# Altium schematic sheet OZ440-SE140-CAR001_sheet2_power_supply.SchDoc
size A3
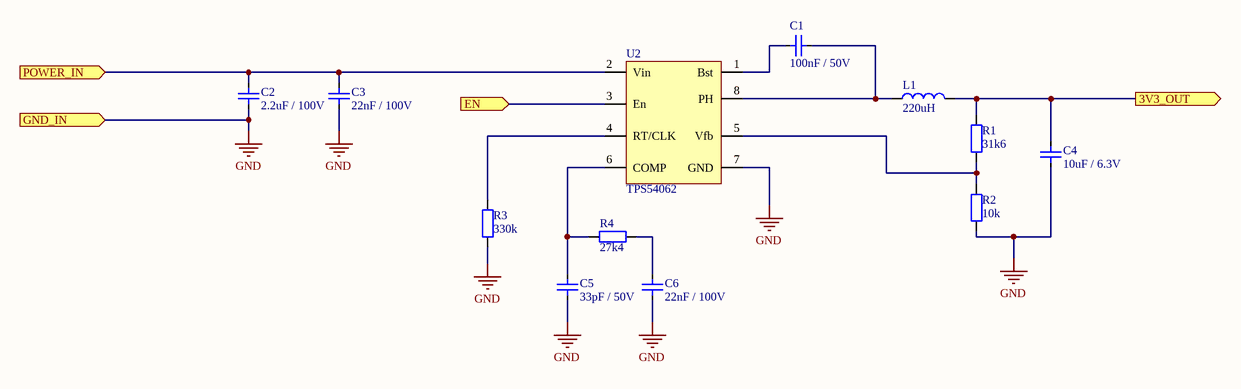
[diagram p0: OZ440-SE140-CAR001_sheet2_power_supply.SchDoc]

## Parts
C1  Displayed reference: 100nF / 50V  [C0805-STD]  (hidden comment: CAP-SMD)
C2  Displayed reference: 2.2uF / 100V  [C1206-STD]  (hidden comment: CAP-SMD)
C3  Displayed reference: 22nF / 100V  [C0805-STD]  (hidden comment: CAP-SMD)
C4  Displayed reference: 10uF / 6.3V  [C0805-STD]  (hidden comment: CAP-SMD)
C5  Displayed reference: 33pF / 50V  [C0805-STD]  (hidden comment: CAP-SMD)
C6  Displayed reference: 22nF / 100V  [C0805-STD]  (hidden comment: CAP-SMD)
L1  Displayed reference: 220uH  [L-SPE-4600Series_Murata]  (hidden comment: IND-SMD)
R1  Displayed reference: 31k6  [R0805-STD]  (hidden comment: RES-SMD)
R2  Displayed reference: 10k  [R0805-STD]  (hidden comment: RES-SMD)
R3  Displayed reference: 330k  [R0805-STD]  (hidden comment: RES-SMD)
R4  Displayed reference: 27k4  [R0805-STD]  (hidden comment: RES-SMD)
U2  Displayed reference: TPS54062  [MSOP08-SPE-TPS54062]  (hidden comment: TPS54062-MSOP8)

## Ports
3V3_OUT (out), EN (in), GND_IN (in), POWER_IN (in)

## Nets
GND: C2.1 C3.1 C4.1 C5.1 C6.1 R2.1 R3.1 U2.7(GND) ; port GND_IN
3V3_OUT: C4.2 L1.2 R1.2 ; port 3V3_OUT
EN: U2.3(En) ; port EN
POWER_IN: C2.2 C3.2 U2.2(Vin) ; port POWER_IN
NetC1_1: C1.1 U2.1(Bst)
NetC1_2: C1.2 L1.1 U2.8(PH)
NetC5_2: C5.2 R4.1 U2.6(COMP)
NetC6_2: C6.2 R4.2
NetR1_1: R1.1 R2.2 U2.5(Vfb)
NetR3_2: R3.2 U2.4(RT/CLK)

## Notes on the sheet
- Titre document:
- NAIO TECHNOLOGIES
- 3 Av didier Daurat
- 31400 TOULOUSE
- Auteur:
- Numéro document:
- Verificateur:
- Format:
- A3
- Date:
- Revision:
- Page:
- /

## Library data of the parts
C1 = VJ0805Y104KXAxx: 0805 100nF / 50V  X7R ceramic capacitor; Manufacturer: vishay; Max Voltage: 50; Tolerance: +/- 10%; Validated: N; Reference: VJ0805Y104KXAxx; Value: 100nF; Material: X7R; Footprint description: standard Capacitor 0805; Pin Count: 2; helpURL: http://www.vishay.com/docs/45200/highrels.pdf; Supplier 1: Farnell; Supplier Part Number 1: 1612208; Supplier 2: Digi-Key; Supplier Part Number 2: 720-1266-6-ND
C2 = C3216X7S2A225Kxxx: 1206 2.2uF / 100V X7S ceramic capacitor; Manufacturer: TDK; Max Voltage: 100; Tolerance: +/- 10%; Validated: N; Reference: C3216X7S2A225Kxxx; Value: 2.2uF; Material: X7S; Footprint description: standard Capacitor 1206; Pin Count: 2; helpURL: http://www.mouser.com/ds/2/400/C3216X7S2A225K160AB-265429.pdf; Supplier 1: Mouser; Supplier Part Number 1: 810-C3216X7S2A225K; Supplier 2: Farnell; Supplier Part Number 2: 2112717
C3 C6 = VJ0805Y223KXBxx: 0805 22nF / 100V X7R ceramic capacitor; Manufacturer: vishay; Value: 100nF; Max Voltage: 100; Tolerance: +/- 10%; Validated: N; Reference: VJ0805Y223KXBxx; Material: X7R; Footprint description: standard Capacitor 0805; Pin Count: 2; helpURL: http://www.vishay.com/docs/45200/highrels.pdf; Supplier 1: Mouser; Supplier Part Number 1: 77-VJ0805Y223KXBBC31; Supplier 2: Farnell; Supplier Part Number 2: 2407374
C4 = C0805C106K9PACxx: 0805 10uF / 6.3V X5R ceramic capacitor; Manufacturer: Kemet; Max Voltage: 6.3; Tolerance: +/- 10%; Validated: N; Reference: C0805C106K9PACxx; Value: 10uF; Material: X5R; Footprint description: standard Capacitor 0805; Pin Count: 2; helpURL: http://www.farnell.com/datasheets/40863.pdf; Supplier 1: Farnell; Supplier Part Number 1: 1643357; Supplier 2: Digi-Key; Supplier Part Number 2: 399-3138-1-ND
C5 = C0805C330J5GACxx: 0805 33pF / 50V COG ceramic capacitor; Manufacturer: Kemet; Max Voltage: 50; Tolerance: +/- 10%; Validated: False; Reference: C0805C330J5GACxx; Value: 33pF; Material: COG; Footprint description: standard Capacitor 0805; Pin Count: 2; helpURL: http://www.farnell.com/datasheets/40863.pdf; Supplier 1: Mouser; Supplier Part Number 1: 80-C0805C330J5GACTM; Supplier 2: Farnell; Supplier Part Number 2: 1414685
L1 = 46224C: 220uH SMD inductor; Manufacturer: MURATA; Reference: 46224C; Max Current: 0.57A; Validated: False; Value: 220uH; Footprint description: SMD 2 pin; Pin Count: 2; Rev: B03; helpURL: http://www.farnell.com/datasheets/1482257.pdf; Supplier 1: Mouser; Supplier Part Number 1: 580-46224C; Supplier 2: Farnell; Supplier Part Number 2: 2062837
R1 = CRCW080531K6FKxx: 31k6 Ohm 0805 SMD resistor; Manufacturer: Vishay; Value: 31 600; Tolerance: 1%; Rated Power: 0.125W; Validated: False; Reference: CRCW080531K6FKxx; Footprint description: standard 0805 SMD; Pin Count: 2; helpURL: http://www.vishay.com/docs/20035/dcrcwe3.pdf; Supplier 1: Mouser; Supplier Part Number 1: 71-CRCW0805-31.6K-E3; Supplier 2: Farnell; Supplier Part Number 2: 1469916
R2 = CRCW080510K0FKxx: 10k Ohm 0805 SMD resistor; Manufacturer: Vishay; Value: 10 000; Tolerance: 1 %; Rated Power: 0,125 W; Validated: No; Reference: CRCW080510K0FKxx; Footprint description: standard 0805 SMD; Pin Count: 2; helpURL: http://www.vishay.com/docs/20035/dcrcwe3.pdf; Supplier 1: Farnell; Supplier Part Number 1: 1469856; Supplier 2: Mouser; Supplier Part Number 2: 71-CRCW0805-10K-E3
R3 = CRCW0805330KFKxx: 330k Ohm 0805 SMD resistor; Manufacturer: Vishay; Value: 330 000; Tolerance: 1%; Rated Power: 0.125W; Validated: False; Reference: CRCW0805330KFKxx; Footprint description: standard 0805 SMD; Pin Count: 2; helpURL: http://www.vishay.com/docs/20035/dcrcwe3.pdf; Supplier 1: Farnell; Supplier Part Number 1: 2123444; Supplier 2: Mouser; Supplier Part Number 2: 71-CRCW0805330KFKEA
R4 = CRCW080527K4FKxx: 27k4 Ohm 0805 SMD resistor; Manufacturer: Vishay; Value: 27 400; Tolerance: 1%; Rated Power: 0.125W; Validated: False; Reference: CRCW080527K4FKxx; Footprint description: standard 0805 SMD; Pin Count: 2; helpURL: http://www.vishay.com/docs/20035/dcrcwe3.pdf; Supplier 1: Mouser; Supplier Part Number 1: 71-CRCW0805-27.4K-E3; Supplier 2: Farnell; Supplier Part Number 2: 1652971RL
U2 = TPS54062DGK: 4.7V to 60V Input, 50mA Synchronous Step-Down Converter; Manufacturer: TI; Max Current: 0.05A; Validated: False; Reference: TPS54062DGK; Max Voltage: 60V; Footprint description: MSOP-8; Pin Count: 8; Rev: 05/2011; helpURL: http://www.ti.com/lit/ds/symlink/tps54062.pdf; Supplier 1: Farnell; Supplier Part Number 1: 2045284; Supplier 2: Mouser; Supplier Part Number 2: 595-TPS54062DGKR